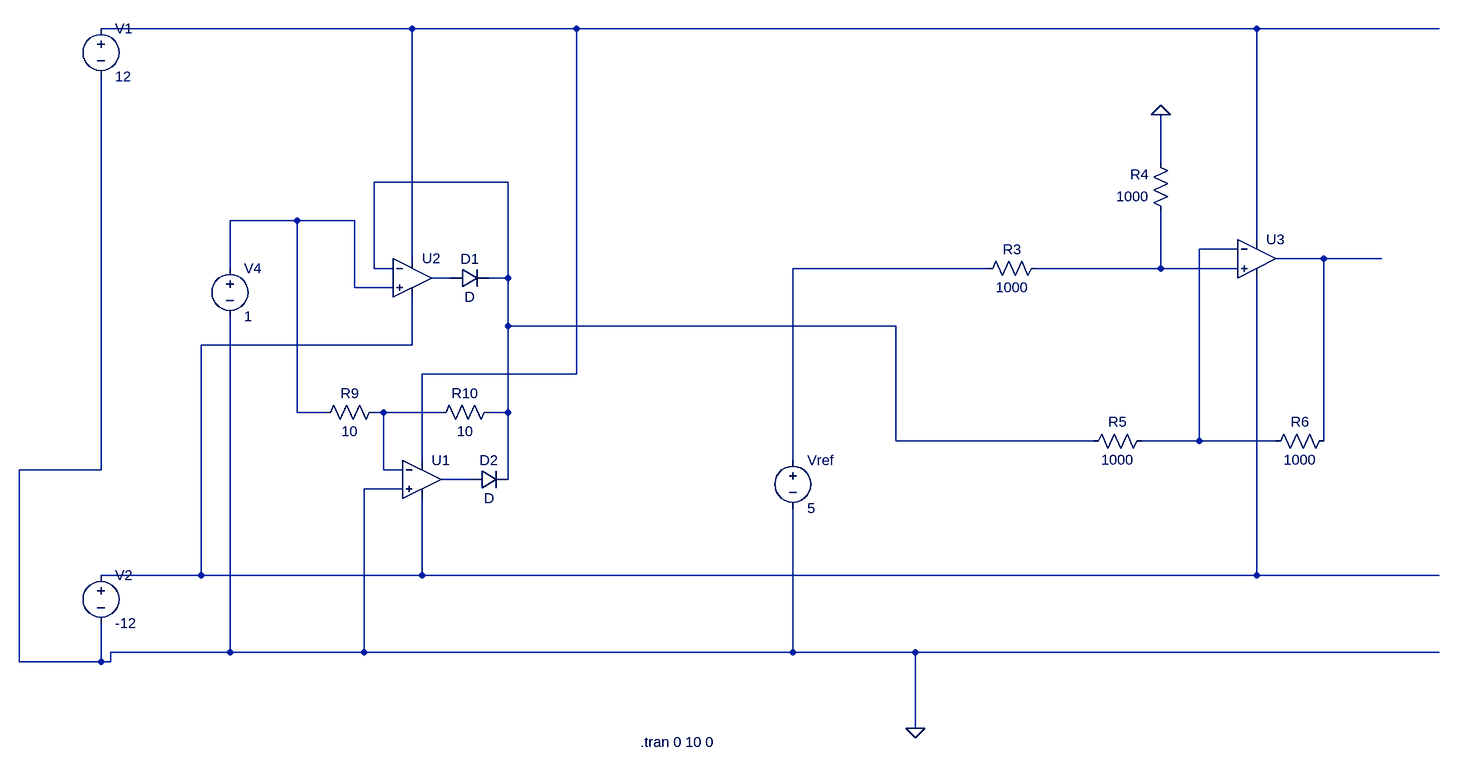
[diagram p0: schematic Control_circuit_schematic_V2.asc]
Control_circuit_schematic_V2.asc, the LTspice schematic file:
Version 4
SHEET 1 1316 920
WIRE -1200 -320 -1824 -320
WIRE -848 -320 -1200 -320
WIRE 1008 -320 -848 -320
WIRE 1312 -320 1008 -320
WIRE 848 -96 848 -176
WIRE -1040 -64 -1264 -64
WIRE -1392 0 -1504 0
WIRE -1296 0 -1392 0
WIRE 1008 32 1008 -320
WIRE 976 48 912 48
WIRE -1200 64 -1200 -320
WIRE 1120 64 1040 64
WIRE 1216 64 1120 64
WIRE -1504 80 -1504 0
WIRE -1264 80 -1264 -64
WIRE -1232 80 -1264 80
WIRE 560 80 48 80
WIRE 848 80 848 -16
WIRE 848 80 640 80
WIRE 976 80 848 80
WIRE -1136 96 -1168 96
WIRE -1040 96 -1040 -64
WIRE -1040 96 -1072 96
WIRE -1296 112 -1296 0
WIRE -1232 112 -1296 112
WIRE -1040 176 -1040 96
WIRE 400 176 -1040 176
WIRE -1200 208 -1200 128
WIRE -1200 208 -1552 208
WIRE -848 256 -848 -320
WIRE -848 256 -1184 256
WIRE -1392 320 -1392 0
WIRE -1344 320 -1392 320
WIRE -1248 320 -1264 320
WIRE -1152 320 -1248 320
WIRE -1040 320 -1040 176
WIRE -1040 320 -1072 320
WIRE 400 368 400 176
WIRE 736 368 400 368
WIRE 912 368 912 48
WIRE 912 368 816 368
WIRE 1040 368 912 368
WIRE 1120 368 1120 64
WIRE -1184 400 -1184 256
WIRE 48 400 48 80
WIRE -1824 416 -1824 -240
WIRE -1824 416 -2032 416
WIRE -1248 416 -1248 320
WIRE -1216 416 -1248 416
WIRE -1104 432 -1152 432
WIRE -1040 432 -1040 320
WIRE -1216 448 -1280 448
WIRE -1552 592 -1552 208
WIRE -1552 592 -1824 592
WIRE -1184 592 -1184 464
WIRE -1184 592 -1552 592
WIRE 1008 592 1008 96
WIRE 1008 592 -1184 592
WIRE 1312 592 1008 592
WIRE -1504 720 -1504 160
WIRE -1504 720 -1808 720
WIRE -1280 720 -1280 448
WIRE -1280 720 -1504 720
WIRE 48 720 48 480
WIRE 48 720 -1280 720
WIRE 432 720 48 720
WIRE 1312 720 432 720
WIRE -2032 736 -2032 416
WIRE -1824 736 -1824 672
WIRE -1824 736 -2032 736
WIRE -1808 736 -1808 720
WIRE -1808 736 -1824 736
WIRE 432 880 432 720
FLAG 432 880 0
FLAG 848 -176 0
DATAFLAG -1504 16 ""
DATAFLAG 784 80 ""
DATAFLAG 1184 64 ""
DATAFLAG 848 368 ""
DATAFLAG -1376 320 ""
DATAFLAG -1216 320 ""
DATAFLAG -912 176 ""
SYMBOL res 656 64 R90
WINDOW 0 0 56 VBottom 2
WINDOW 3 32 56 VTop 2
SYMATTR InstName R3
SYMATTR Value 1000
SYMBOL res 864 0 R180
WINDOW 0 36 76 Left 2
WINDOW 3 36 40 Left 2
SYMATTR InstName R4
SYMATTR Value 1000
SYMBOL res 720 384 R270
WINDOW 0 32 56 VTop 2
WINDOW 3 0 56 VBottom 2
SYMATTR InstName R5
SYMATTR Value 1000
SYMBOL res 1024 384 R270
WINDOW 0 32 56 VTop 2
WINDOW 3 0 56 VBottom 2
SYMATTR InstName R6
SYMATTR Value 1000
SYMBOL voltage 48 384 R0
WINDOW 123 0 0 Left 0
WINDOW 39 0 0 Left 0
SYMATTR InstName Vref
SYMATTR Value 5
SYMBOL res -1248 304 R90
WINDOW 0 0 56 VBottom 2
WINDOW 3 32 56 VTop 2
SYMATTR InstName R9
SYMATTR Value 10
SYMBOL res -1056 304 R90
WINDOW 0 0 56 VBottom 2
WINDOW 3 32 56 VTop 2
SYMATTR InstName R10
SYMATTR Value 10
SYMBOL diode -1136 112 R270
WINDOW 0 32 32 VTop 2
WINDOW 3 0 32 VBottom 2
SYMATTR InstName D1
SYMBOL diode -1104 448 R270
WINDOW 0 32 32 VTop 2
WINDOW 3 0 32 VBottom 2
SYMATTR InstName D2
SYMBOL voltage -1504 64 R0
WINDOW 123 0 0 Left 0
WINDOW 39 0 0 Left 0
SYMATTR InstName V4
SYMATTR Value 1
SYMBOL voltage -1824 -336 R0
WINDOW 123 0 0 Left 0
WINDOW 39 0 0 Left 0
SYMATTR InstName V1
SYMATTR Value 12
SYMBOL voltage -1824 576 R0
WINDOW 123 0 0 Left 0
WINDOW 39 0 0 Left 0
SYMATTR InstName V2
SYMATTR Value -12
SYMBOL UniversalOpamp2 -1184 432 R0
SYMATTR InstName U1
SYMBOL UniversalOpamp2 -1200 96 R0
SYMATTR InstName U2
SYMBOL UniversalOpamp2 1008 64 R0
SYMATTR InstName U3
TEXT -608 904 Left 2 !.tran 0 10 0

The netlist it stands for:
* Control_circuit_schematic_V2.asc
R3 N007 N006 1000
R4 N007 0 1000
R5 N002 N004 1000
R6 N004 N005 1000
Vref N006 0 5
R9 N010 N003 10
R10 N002 N010 10
D1 N008 N002 D
D2 N011 N002 D
V4 N003 0 1
V1 N001 0 12
V2 N009 0 -12
XU1 0 N010 N001 N009 N011 level.2 Avol=1Meg GBW=10Meg Slew=10Meg ilimit=25m rail=0 Vos=0 phimargin=45 en=0 enk=0 in=0 ink=0 Rin=500Meg  ; pins IN+ IN- V+ V- OUT
XU2 N003 N002 N001 N009 N008 level.2 Avol=1Meg GBW=10Meg Slew=10Meg ilimit=25m rail=0 Vos=0 phimargin=45 en=0 enk=0 in=0 ink=0 Rin=500Meg  ; pins IN+ IN- V+ V- OUT
XU3 N007 N004 N001 N009 N005 level.2 Avol=1Meg GBW=10Meg Slew=10Meg ilimit=25m rail=0 Vos=0 phimargin=45 en=0 enk=0 in=0 ink=0 Rin=500Meg  ; pins IN+ IN- V+ V- OUT
.model D D
.lib standard.dio
.tran 0 10 0
.lib UniversalOpamps2.sub
.backanno
.end